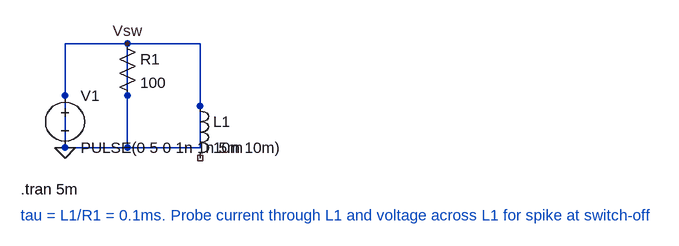
[diagram p0: schematic 04_RL_transient.asc]
04_RL_transient.asc, the LTspice schematic file:
Version 4
SHEET 1 880 680
WIRE 224 96 128 96
WIRE 336 96 224 96
WIRE 128 176 128 96
WIRE 224 176 224 96
WIRE 336 176 336 96
WIRE 128 256 128 176
WIRE 224 256 224 176
WIRE 224 256 128 256
WIRE 336 256 336 176
WIRE 336 256 224 256
FLAG 128 256 0
FLAG 224 96 Vsw
SYMBOL voltage 128 160 R0
SYMATTR InstName V1
SYMATTR Value PULSE(0 5 0 1n 1n 5m 10m)
SYMBOL res 208 80 R0
SYMATTR InstName R1
SYMATTR Value 100
SYMBOL ind 320 176 R0
SYMATTR InstName L1
SYMATTR Value 10m
TEXT 60 320 Left 2 !.tran 5m
TEXT 60 360 Left 2 ;tau = L1/R1 = 0.1ms. Probe current through L1 and voltage across L1 for spike at switch-off

The netlist it stands for:
* 04_RL_transient.asc
V1 0 0 PULSE(0 5 0 1n 1n 5m 10m)
R1 0 0 100
L1 0 NC_01 10m
.tran 5m
* tau = L1/R1 = 0.1ms. Probe current through L1 and voltage across L1 for spike at switch-off
.backanno
.end